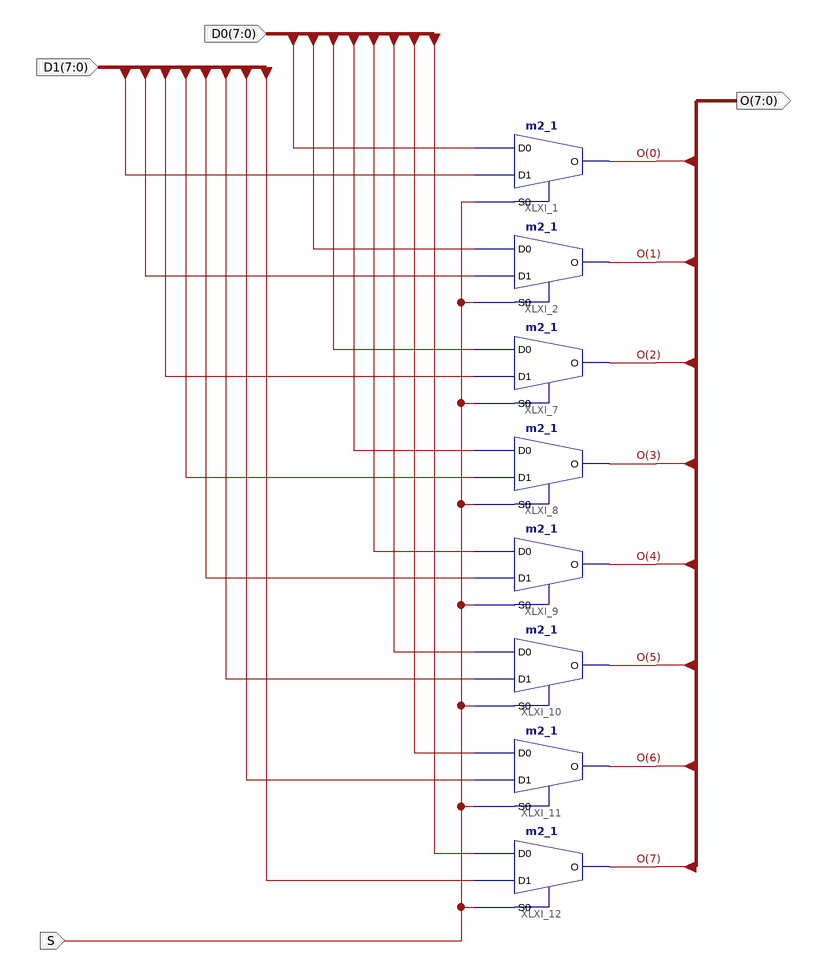
[diagram p0: schematic sheet 1]
// Xilinx ISE schematic mux2x1x8.sch (spartan6) as structural Verilog: 8 symbols, 4 ports
module mux2x1x8 (
  input  [7:0] D1,
  input  [7:0] D0,
  input  S,
  output [7:0] O
);

  wire XLXN_13, XLXN_14, XLXN_15, XLXN_16, XLXN_18, XLXN_19, XLXN_20, XLXN_21, XLXN_22, XLXN_23, XLXN_24,
       XLXN_25, XLXN_26, XLXN_27, XLXN_28, XLXN_29;

  m2_1 XLXI_1 (.D0(XLXN_13), .D1(XLXN_14), .S0(S), .O(O[0]));
  m2_1 XLXI_2 (.D0(XLXN_15), .D1(XLXN_16), .S0(S), .O(O[1]));
  m2_1 XLXI_7 (.D0(XLXN_18), .D1(XLXN_19), .S0(S), .O(O[2]));
  m2_1 XLXI_8 (.D0(XLXN_20), .D1(XLXN_21), .S0(S), .O(O[3]));
  m2_1 XLXI_9 (.D0(XLXN_22), .D1(XLXN_23), .S0(S), .O(O[4]));
  m2_1 XLXI_10 (.D0(XLXN_24), .D1(XLXN_25), .S0(S), .O(O[5]));
  m2_1 XLXI_11 (.D0(XLXN_26), .D1(XLXN_27), .S0(S), .O(O[6]));
  m2_1 XLXI_12 (.D0(XLXN_28), .D1(XLXN_29), .S0(S), .O(O[7]));
endmodule
